# EAGLE design Schematic (EAGLE 8.0.0)
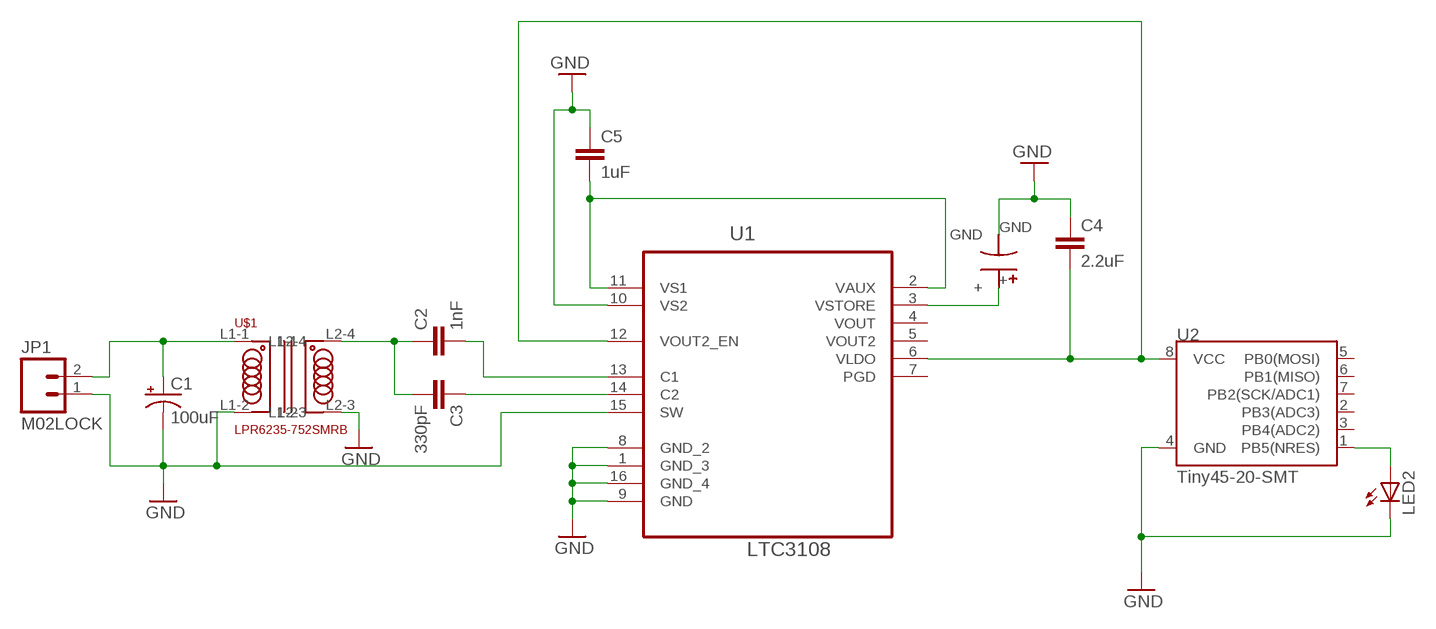
[diagram p0: schematic, sheet 1]

## Parts
C1  100uF  10UF-16V-10%(TANT)  [EIA3216]
C2  1nF  CAP0603-CAP  [0603-CAP]
C3  330pF  CAP0603-CAP  [0603-CAP]
C4  2.2uF  CAP0603-CAP  [0603-CAP]
C5  1uF  CAP0603-CAP  [0603-CAP]
JP1  M02LOCK  [1X02_LOCK]
LED2  LEDCHIPLED_0805  [CHIPLED_0805]
U1  LTC3108  LTC3108IGNPBF  [SOP63P600X175-16N]
U2  Tiny45-20-SMT  ATTINY45TINY45-20-SMT  [SO08-EIAJ]
U$1  LPR6235-752SMRB  [LPR6235-752SMRB]
U$2  0.1F 3.5V  FC0V104FTBR24  [FC0V104ZFTBR24]

## Nets
GND: C1.C(-) C4.1 C5.1 JP1.1 LED2.C U1.1(GND_3) U1.8(GND_2) U1.9(GND) U1.10(VS2) U1.15(SW) U1.16(GND_4) U2.4(GND) U$1.L1-2 U$1.L2-3
N$1: C2.1 C3.2 U$1.L2-4
N$2: C5.2 U1.2(VAUX) U1.11(VS1)
N$3: C2.2 U1.13(C1)
N$4: C3.1 U1.14(C2)
N$6: U1.3(VSTORE) U$2.+
N$7: C4.2 U1.6(VLDO) U1.12(VOUT2_EN) U2.8(VCC)
N$8: LED2.A U2.1(PB5(NRES))
N$9: C1.A(+) JP1.2 U$1.L1-1
Unconnected: U1.4(VOUT) U1.5(VOUT2) U1.7(PGD) U2.2(PB3(ADC3)) U2.3(PB4(ADC2)) U2.5(PB0(MOSI)) U2.6(PB1(MISO)) U2.7(PB2(SCK/ADC1)) U$2.GND

## Library data of the parts
C1 = SparkFun-Capacitors:10UF-16V-10%(TANT): CAP-00811 1206/EIA-3216 Tantalum capacitor; PROD_ID: CAP-00811; VALUE: 10uF
C2-C5 = SparkFun-Capacitors:CAP: Capacitor Standard 0603 ceramic capacitor, and 0.1" leaded capacitor.
JP1 = SparkFun-Connectors:M02: Standard 2-pin 0.1" header. Use with - straight break away headers ( PRT-00116) - right angle break away headers (PRT-00553) - swiss pins (PRT-00743) - machine pins (PRT-00117) - female headers (PRT-00115) Molex polarized connector foot print use with: PRT-08233 with associated crimp pins and housings. 2.54_SCREWTERM for use with PRT-10571. 3.5mm Screw Terminal footprints for PRT-08084 5mm Screw Terminal footprints for use with PRT-08433
LED2 = adafruit:LED: LED OSRAM: - CHIPLED LG R971, LG N971, LY N971, LG Q971, LY Q971, LO R971, LY R971 LH N974, LH R974 LS Q976, LO Q976, LY Q976 LO Q996 - Hyper CHIPLED LW Q18S LB Q993, LB Q99A, LB R99A - SideLED LS A670, LO A670, LY A670, LG A670, LP A670 LB A673, LV A673, LT A673, LW A673 LH A674 LY A675 LS A676, LA A676, LO A676, LY A676, LW A676 LS A679, LY A679, LG A679 - Hyper Micro SIDELED® LS Y876, LA Y876, LO Y876, LY Y876 LT Y87S - SmartLED LW L88C, LW L88S LB L89C, LB L89S, LG L890 LS L89K, LO L89K, LY L89K LS L896, LA L896, LO L896, LY L896 - TOPLED LS T670, LO T670, LY T670, LG T670, LP T670 LSG T670, LSP T670, LSY T670, LOP T670, LYG T670 LG T671, LOG T671, LSG T671 LB T673, LV T673, LT T673, LW T673 LH T674 LS T676, LA T676, LO T676, LY T676, LB T676, LH T676, LSB T676, LW T676 LB T67C, LV T67C, LT T67C, LS T67K, LO T67K, LY T67K, LW E67C LS E67B, LA E67B, LO E67B, LY E67B, LB E67C, LV E67C, LT E67C LW T67C LS T679, LY T679, LG T679 LS T770, LO T770, LY T770, LG T770, LP T770 LB T773, LV T773, LT T773, LW T773 LH T774 LS E675, LA E675, LY E675, LS T675 LS T776, LA T776, LO T776, LY T776, LB T776 LHGB T686 LT T68C, LB T68C - Hyper Mini TOPLED® LB M676 - Mini TOPLED Santana® LG M470 LS M47K, LO M47K, LY M47K Source: http://www.osram.convergy.de/
U1 = LTC:LTC3108IGNPBF: Ultralow Voltage Step-Up Converter and Power Manager; MPN: LTC3108IGN#PBF; OC_FARNELL: 1799834; OC_NEWARK: 67R4280; PACKAGE: SSOP-16; SUPPLIER: Linear Technology
U2 = SparkFun-DigitalIC:ATTINY45: Atmel 8-pin 2/4/8kB flash uC; PROD_ID: IC-08922
U$1 = JeffThompson_ORIG:LPR6235-752SMRB: Coilcraft 100:1 SMD transformer LPR6235-752SMRB https://www.mouser.com/ds/2/597/Coilcraft_lpr6235-1214787.pdf
U$2 = JeffThompson_ORIG:FC0V104FTBR24: 0.1F 3.5V supercapacitor Kemet FC0V104ZFTBR24 https://content.kemet.com/datasheets/KEM_S6011_FC.pdf

## Board
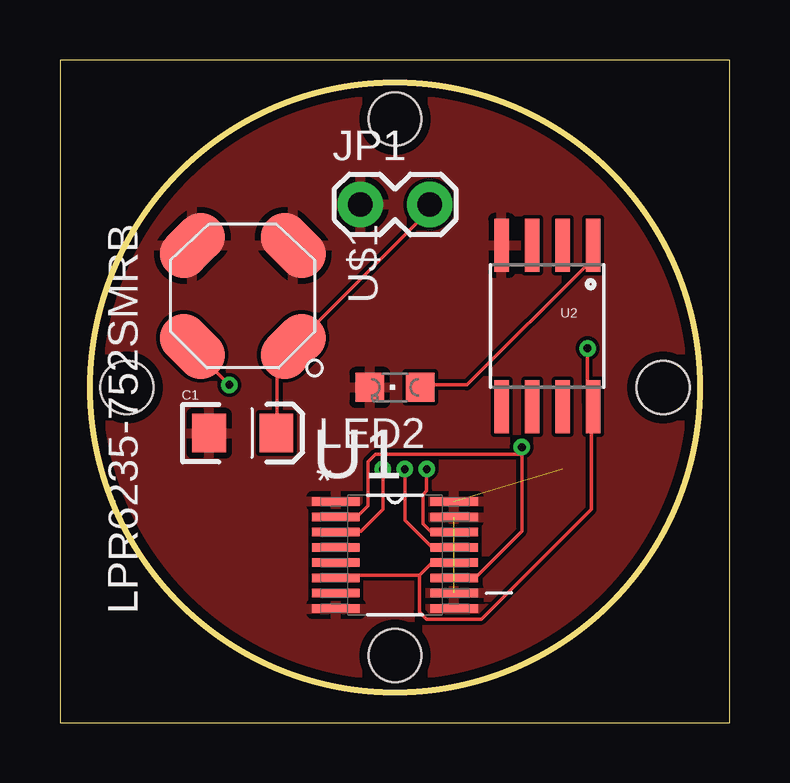
[diagram p1: board, top side]
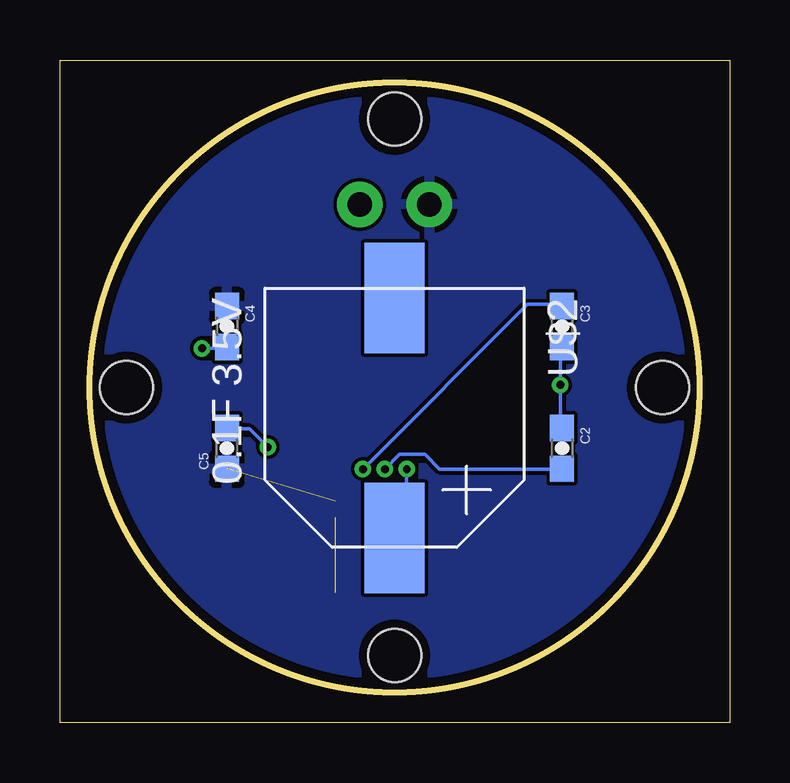
[diagram p2: board, bottom side, seen from below]

Size 27.92 x 27.61 mm. Coordinates in mm from the lower left corner, seen from the top.
Outline: 0,0 27.92,0 27.92,27.61 0,27.61 0,0
Outline: circle at 13.97,13.97 radius 12.7
Copper layers (1*16): Top 0.0356mm / dielectric 1.5011mm / Bottom 0.0356mm
Design rules "OSHPark": minimum track width 6mil, minimum drill 13mil, track to track 6mil, track to pad 6mil, pad to pad 6mil, via to via 6mil, smd to smd 6mil, copper to edge 15mil, drill to drill 6mil, minimum pad ring 7mil, minimum via ring 7mil, stop-mask expansion 4mil, vias tented up to drill 0mil, thermal gap 10mil
Holes 2.21 mm at 13.97,25.15 2.79,13.97 25.15,13.97 13.97,2.79

### Footprints (pad centres in the part's own frame; a part is rotated, then mirrored left to right if it is on the bottom)
EIA3216 = smd 1.4 x 1.6: A 1.4,0; C -1.4,0
0603-CAP = smd 1.1 x 1: 1 -0.85,0; 2 0.85,0
1X02_LOCK = drill 1.016 pad 1.88: 1 -0.178,0; 2 2.718,0
CHIPLED_0805 = smd 1.2 x 1.2: A 0,-1.05; C 0,1.05
SOP63P600X175-16N = smd 1.981 x 0.356: 1 -2.464,2.235; 2 -2.464,1.575; 3 -2.464,0.965; 4 -2.464,0.305; 5 -2.464,-0.305; 6 -2.464,-0.965; 7 -2.464,-1.575; 8 -2.464,-2.235; 9 2.464,-2.235; 10 2.464,-1.575; 11 2.464,-0.965; 12 2.464,-0.305; 13 2.464,0.305; 14 2.464,0.965; 15 2.464,1.575; 16 2.464,2.235
SO08-EIAJ = smd 0.61 x 2.21: 1 -1.905,-3.378; 2 -0.635,-3.378; 3 0.635,-3.378; 4 1.905,-3.378; 5 1.905,3.353; 6 0.635,3.353; 7 -0.635,3.353; 8 -1.905,3.353
LPR6235-752SMRB = smd 3 x 2 rotated 45: L1-1 -2.105,2.105; L2-3 2.105,-2.105 | smd 2 x 3 rotated 45: L1-2 -2.105,-2.105; L2-4 2.105,2.105
FC0V104ZFTBR24 = smd 2.5 x 4.6: + 0,5; GND 0,-5

### Placement (x,y rotation side)
C1  7.62,12.06 0 top
C2  6.98,11.43 270 bottom
C3  6.98,16.51 270 bottom
C4  20.95,16.51 270 bottom
C5  20.95,11.43 90 bottom
JP1  12.7,21.59 0 top
LED2  13.97,13.97 90 top
U1  13.97,6.98 0 top
U2  20.32,16.51 180 top
U$1  7.62,17.78 180 top
U$2  13.97,12.7 180 bottom

### Tracks (layer width: path | path; a pad name or v marks a point on that pad's centre or on a via)
GND  (2 unrouted)
  pour Bottom: -2.54,27.94 27.94,27.94 27.94,0 -2.54,0
  pour Top: -1.27,27.94 29.21,27.94 29.21,0 -1.27,0
N$1  (via drill 0.33)
  Top 0.152: v7.06,14.07 5.54,15.6 U$1.L2-4
  Bottom 0.152: C2.1 7.06,12.39 v7.06,14.07 7.06,15.6 C3.2
N$2  (via drill 0.33)
  Top 0.152: 19.25,11.18 19.25,7.98 17.42,6.15 16.51,6.15 U1.11 | 19.25,11.18 13.16,11.18 12.85,10.87 12.85,9.04 12.39,8.59 11.63,8.59 U1.2 | 19.25,11.18 v19.25,11.48
  Bottom 0.152: v19.25,11.48 20.02,12.24 20.93,12.24 C5.2
N$3  (via drill 0.33)
  Top 0.152: v14.38,10.57 14.38,8.43 15.44,7.37 16.36,7.37 U1.13
  Bottom 0.152: v14.38,10.57 13.77,11.18 12.7,11.18 12.09,10.57 7.06,10.57 C2.2
N$4  (via drill 0.33)
  Top 0.152: v15.29,10.57 15.29,9.65 15.14,9.5 15.14,8.28 15.44,7.98 16.36,7.98 U1.14
  Bottom 0.152: v15.29,10.57 8.43,17.42 7.06,17.42 C3.1
N$6  (via drill 0.33)
  Top 0.152: v13.46,10.57 13.46,8.89 12.55,7.98 11.63,7.98 U1.3
  Bottom 0.152: v13.46,10.57 13.46,8.28 13.92,7.82 U$2.+
N$7  (via drill 0.33)
  Top 0.152: v22,15.6 22,13.31 22.15,13.16 | 14.99,6.15 11.63,6.15 U1.6 | 14.99,6.15 15.44,6.6 16.36,6.6 U1.12 | 22.15,13.16 22.15,8.89 17.58,4.32 15.29,4.32 14.99,4.62 14.99,6.15 | 22.15,13.16 U2.8
  Bottom 0.152: v22,15.6 21.08,15.6 C4.2
N$8
  Top 0.152: LED2.A 15.14,14.07 16.97,14.07 22.15,19.25 22.15,19.86 U2.1
N$9
  Top 0.152: C1.A 9.04,12.09 9.04,14.99 9.65,15.6 U$1.L1-1 9.8,15.75 15.29,21.23 15.29,21.54 JP1.2